# Altium project cameras.PrjPcb
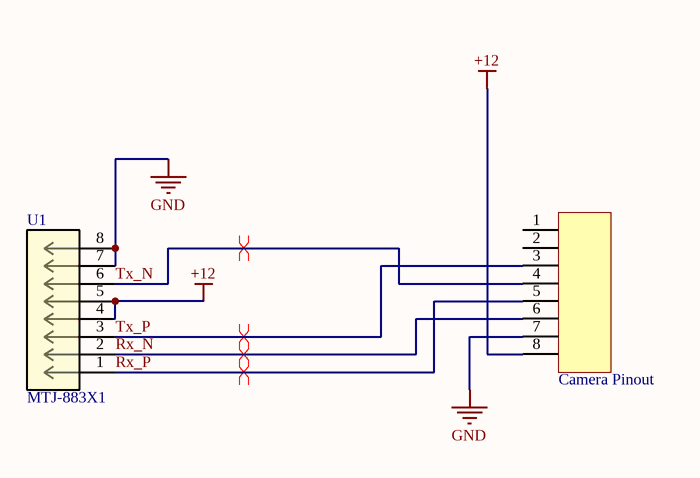
[diagram p0: cameras.SchDoc]
1 sheet, 2 parts. Net scope: global (net labels, ports and power ports of the same name join across sheets).
Board file: cameras.PcbDoc

## Sheet cameras.SchDoc
size A4; SheetNumber: 1; SheetTotal: 1

### Parts
U1  MTJ-883X1  [CONN_MTJ-883X1_ADM]
  Camera Pinout  [PCBComponent_1]

### Nets
+12: U1.4 U1.5 .8
GND: U1.7 U1.8 .7
Rx_N: U1.2 .6
Rx_P: U1.1 .5
Tx_N: U1.6 .4
Tx_P: U1.3 .3

Not connected (* = marked no-connect by the designer):  1 2

### Layout directives
differential pair: Rx_N, Rx_P, Tx_N, Tx_P

### Library data of the parts
U1 = MTJ-883X1: No Description Available; Mfr_Name: ADAM TECHNOLOGIES INC; RefDes: RefDes; Type: Type
 = Component_1